# Altium project CH334-USB-HUB.PrjPcb
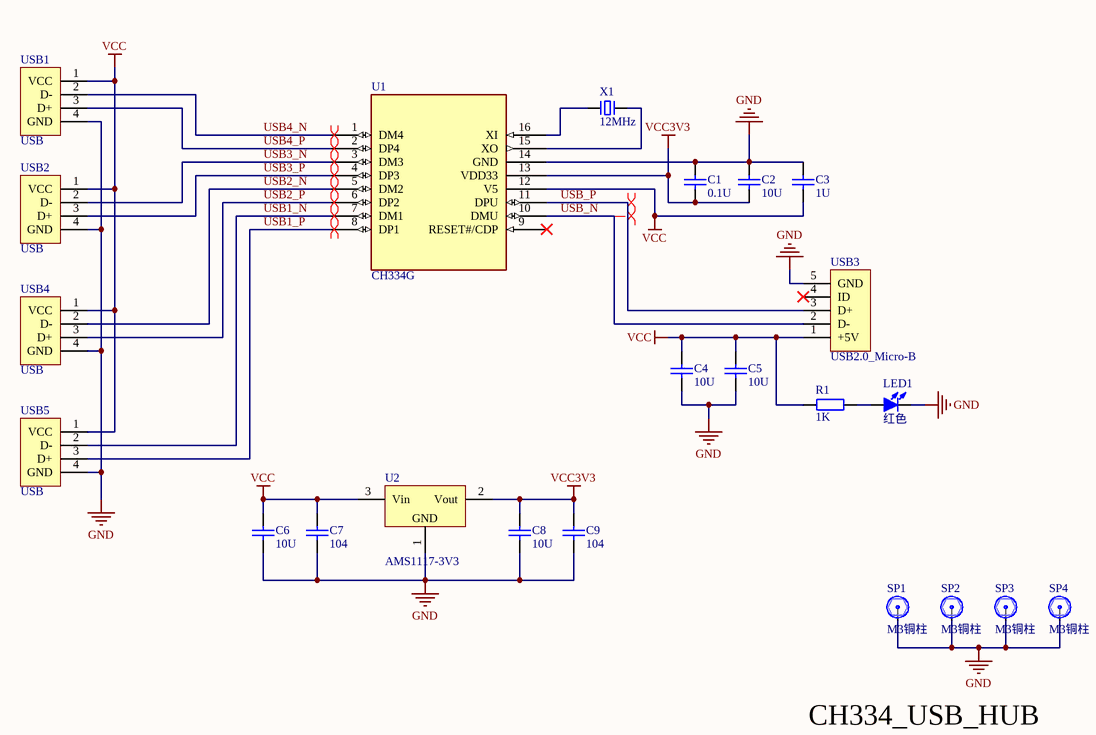
[diagram p0: mian.SchDoc]
1 sheet, 23 parts. Net scope: global (net labels, ports and power ports of the same name join across sheets).
Board file: main.PcbDoc

## Sheet mian.SchDoc
size A4; SheetNumber: 1; SheetTotal: 1

### Parts
C1  0.1U  [C0805_L]
C2  10U  [C0805_L]
C3  1U  [C0805_L]
C4  10U  [C0805_L]
C5  10U  [C0805_L]
C6  10U  [C0805_L]
C7  104  [C0805_L]
C8  10U  [C0805_L]
C9  104  [C0805_L]
LED1  红色  [LED0805_R]
R1  1K  [R0805_L]
SP1  M3铜柱  [M3x4_N]
SP2  M3铜柱  [M3x4_N]
SP3  M3铜柱  [M3x4_N]
SP4  M3铜柱  [M3x4_N]
U1  CH334G  [SOP16]
U2  AMS1117-3V3  [SOT223_M]
USB1  USB  [USB2.0_Type-A_DIP_F_1]
USB2  USB  [USB2.0_Type-A_DIP_F_1]
USB3  USB2.0_Micro-B  [USB2.0_MICRO-B_1]
USB4  USB  [USB2.0_Type-A_DIP_F_1]
USB5  USB  [USB2.0_Type-A_DIP_F_1]
X1  12MHz  [HC-49S]

### Nets
GND: C1.2 C2.2 C3.2 C4.1 C5.1 C6.1 C7.1 C8.1 C9.1 LED1.2(K) SP1.1 SP2.1 SP3.1 SP4.1 U1.14(GND) U2.1(GND) USB1.4(GND) USB2.4(GND) USB3.5(GND) USB4.4(GND) USB5.4(GND)
VCC: C3.1 C4.2 C5.2 C6.2 C7.2 R1.1 U1.12(V5) U2.3(Vin) USB1.1(VCC) USB2.1(VCC) USB3.1(+5V) USB4.1(VCC) USB5.1(VCC)
VCC3V3: C1.1 C2.1 C8.2 C9.2 U1.13(VDD33) U2.2(Vout)
USB1_N: U1.7(DM1) USB5.2(D-)
USB1_P: U1.8(DP1) USB5.3(D+)
USB2_N: U1.5(DM2) USB4.2(D-)
USB2_P: U1.6(DP2) USB4.3(D+)
USB3_N: U1.3(DM3) USB2.2(D-)
USB3_P: U1.4(DP3) USB2.3(D+)
USB4_N: U1.1(DM4) USB1.2(D-)
USB4_P: U1.2(DP4) USB1.3(D+)
USB_N: U1.10(DMU) USB3.2(D-)
USB_P: U1.11(DPU) USB3.3(D+)
NetLED1_1: LED1.1(A) R1.2
NetU1_15: U1.15(XO) X1.2
NetU1_16: U1.16(XI) X1.1

Not connected (* = marked no-connect by the designer): U1 9(RESET#/CDP)*; USB3 4(ID)*

### Layout directives
differential pair: USB1_N, USB1_P, USB2_N, USB2_P, USB3_N, USB3_P, USB4_N, USB4_P, USB_N, USB_P

### Notes on the sheet
- CH334_USB_HUB

### Library data of the parts
C1-C9 = C: 贴片电容/MLCC电容; BOM名称: 无极性贴片电容; 联系卖家，免费查找封装: 唯一出售店铺网址https://shop463601444.taobao.com
LED1 = LED-SMD: 贴片LED; 封装库来自淘宝卖家ID：黄晶宝石: 其他店铺购入均为盗版封装库，请立即申请退款，本店现金奖励20~200元; BOM名称: 贴片LED
R1 = R: 贴片电阻; 联系卖家，免费查找封装: 唯一出售店铺网址https://shop463601444.taobao.com; BOM名称: 贴片电阻
SP1-SP4 = 铜柱大焊盘: 铜柱; 联系卖家，免费查找封装: 唯一出售店铺网址https://shop463601444.taobao.com; 封装库来自淘宝卖家ID：黄晶宝石: 其他店铺购入的，请立即申请退款，本店现金奖励20~500元; BOM名称: 铜柱
U1 = CH334G: 4 ports High-Speed USB STT Hub
U2 = AMS1117_SOT89: 三端稳压芯片; BOM名称: 稳压芯片; 封装库来自淘宝卖家ID：黄晶宝石: 其他店铺购入的买家，请立即申请退款，本店现金奖励20~1000元
USB1 USB2 USB4 USB5 = USB2.0_Type-A_F: USB2.0_Type-A母座; 联系卖家 免费技术支持: 封装库来自淘宝卖家ID：黄晶宝石; BOM名称: USB2.0_Type-A母座
USB3 = USB2.0_Micro-B: USB2.0_Micro-B母座; 联系卖家 免费技术支持: 封装库来自淘宝卖家ID：黄晶宝石; BOM名称: USB2.0_Micro-B母座
X1 = XTAL-2P: 2脚无源晶振(谐振器）; 联系卖家，免费查找封装: 唯一出售店铺网址https://shop463601444.taobao.com; BOM名称: 2脚无源晶振(谐振器）